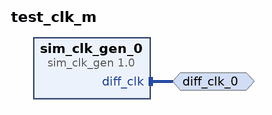
[diagram p0: block diagram of the top level]
# Vivado block design test_clk_m, xc7vx485tffg1761-2, Vivado 2018.3
create_bd_design test_clk_m

create_bd_intf_port -mode Master -vlnv xilinx.com:interface:diff_clock_rtl:1.0 diff_clk_0

create_bd_cell -type ip -vlnv xilinx.com:ip:sim_clk_gen:1.0 sim_clk_gen_0
set_property -dict {CONFIG.CLOCK_TYPE Differential CONFIG.FREQ_HZ 200000000} [get_bd_cells sim_clk_gen_0]

# ---- connections ----

connect_bd_intf_net [get_bd_intf_ports diff_clk_0] [get_bd_intf_pins sim_clk_gen_0/diff_clk]

validate_bd_design
save_bd_design
